# EAGLE design BackscatterPlantSensor_v6_3tssop_coax_rmi_2layer (EAGLE 6.4)

## Sheet 1 of 4
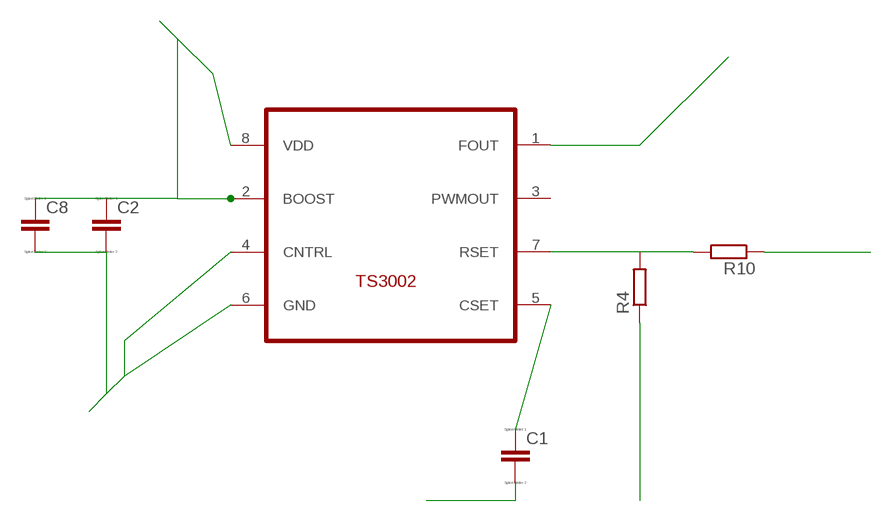
[diagram p0: schematic, sheet 1]

### Parts
C1  CC0603  [C0603]
C2  CC0603  [C0603]
C8  CC0603  [C0603]
R4  R-EU_R0603  [R0603]
R10  R-EU_R0603  [R0603]
U$1  TS3002  [TDFN22-8]

### Nets
AGND: R4.1 ; also sheet 4
DGND: C1.2 C2.2 C8.2 U$1.4(CNTRL) U$1.6(GND) ; also sheet 2
FOUT: U$1.1(FOUT) ; also sheet 2
N$1: C1.1 U$1.5(CSET)
N$2: R4.2 R10.2 U$1.7(RSET)
VCOND: R10.1 ; also sheet 4
VDD: C2.1 C8.1 U$1.2(BOOST) U$1.8(VDD) ; also sheet 3,4
Unconnected: U$1.3(PWMOUT)

## Sheet 2 of 4
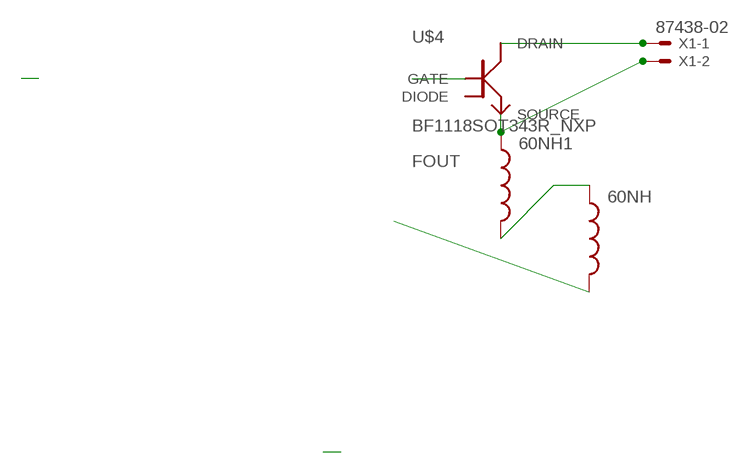
[diagram p1: schematic, sheet 2]

### Parts
60NH  INDUCTOR0402  [C0402]
60NH1  INDUCTOR0402  [C0402]
U$4  BF1118SOT343R_NXP  [SOT343R]
X1  87438-02  [87438-02]

### Nets
DGND: U$4.1(GATE) ; also sheet 1
FOUT: 60NH.2 ; also sheet 1
N$3: 60NH1.2 60NH.1
RF_MINUS: 60NH1.1 U$4.3(SOURCE) X1.2
RF_PLUS: U$4.4(DRAIN) X1.1
Unconnected: U$4.2(DIODE)

## Sheet 3 of 4
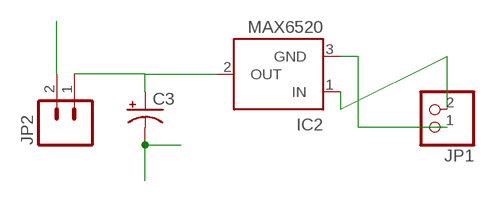
[diagram p2: schematic, sheet 3]

### Parts
C3  CAP_POL1206  [EIA3216]
IC2  MAX6520  [SOT23]
JP1  PINHD-1X2  [1X02]
JP2  M02LOCK  [1X02_LOCK]

### Nets
GND: C3.C(-) IC2.3(GND) JP1.1
N$4: IC2.1(IN) JP1.2
N$7: C3.A(+) IC2.2(OUT) JP2.1
VDD: JP2.2 ; also sheet 1,4

## Sheet 4 of 4
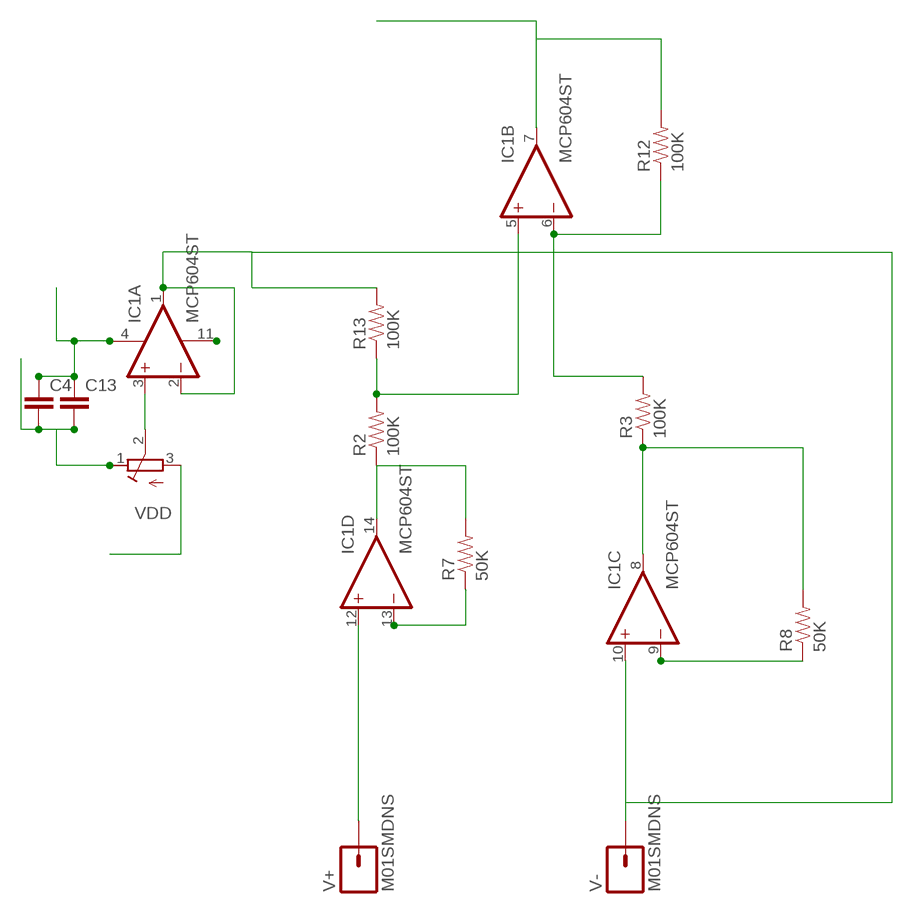
[diagram p3: schematic, sheet 4]

### Parts
C4  CAP0603-CAP  [0603-CAP]
C13  CAP0603-CAP  [0603-CAP]
IC1  MCP604ST  [TSSOP14]
R2  100K  RESISTOR  [0805]
R3  100K  RESISTOR  [0805]
R7  50K  RESISTOR  [0805]
R8  50K  RESISTOR  [0805]
R12  100K  RESISTOR  [0805]
R13  100K  RESISTOR  [0805]
V+  M01SMDNS  [1X01NS]
V-  M01SMDNS  [1X01NS]
VDD  R-TRIMM3314G  [RTRIM3314G]

### Nets
AGND: C4.2 C13.2 IC1.11(P:V-) VDD.1(E) ; also sheet 1
N$93: IC1.9(C:-IN) R8.1
N$96: IC1.8(C:OUT) R3.1 R8.2
N$99: IC1.14(D:OUT) R2.1 R7.2
N$100: IC1.6(B:-IN) R3.2 R12.1
N$119: IC1.3(A:+IN) VDD.2(S)
N$120: IC1.13(D:-IN) R7.1
N$122: IC1.5(B:+IN) R2.2 R13.1
V+: IC1.12(D:+IN) V+.1
VCOND: IC1.7(B:OUT) R12.2 ; also sheet 1
VDD: C4.1 C13.1 IC1.4(P:V+) VDD.3(A) ; also sheet 1,3
VRF: IC1.1(A:OUT) IC1.2(A:-IN) IC1.10(C:+IN) R13.2 V-.1

## Library data of the parts
60NH 60NH1 = SparkFun:INDUCTOR: Inductors Basic Inductor/Choke - 0603 and 1206. Footprints are not proven and vary greatly between part numbers.
C1 C2 C8 = eagle-ltspice:C: CAPACITOR, European symbol; SPICEMODEL: NONE; SPICEPREFIX: C
C3 = SparkFun-Capacitors:CAP_POL: Capacitor Polarized These are standard SMD and PTH capacitors. Normally 10uF, 47uF, and 100uF in electrolytic and tantalum varieties. Always verify the external diameter of the through hole cap, it varies with capacity, voltage, and manufacturer. The EIA devices should be standard.
C4 C13 = SparkFun-Passives:CAP: Capacitor Standard 0603 ceramic capacitor, and 0.1" leaded capacitor.
IC1 = linear:MCP604: Quad Op Amp 2.7V to 6.0V Single Supply CMOS Source: http://ww1.microchip.com/downloads/en/DeviceDoc/21314g.pdf
IC2 = maxim:MAX6520: 1.2V Voltage Reference 50ppm/°C, SOT23, 3-Terminal Source: Data sheet <http://datasheets.maxim-ic.com/en/ds/MAX6520.pdf>; MF: MAXIM; MPN: MAX6520EUR-T; OC_FARNELL: unknown; OC_NEWARK: 02J4586
JP1 = pinhead:PINHD-1X2: PIN HEADER
JP2 = SparkFun-Connectors:M02: Header 2 Standard 2-pin 0.1" header. Use with straight break away headers (SKU : PRT-00116), right angle break away headers (PRT-00553), swiss pins (PRT-00743), machine pins (PRT-00117), and female headers (PRT-00115). Molex polarized connector foot print use with SKU : PRT-08233 with associated crimp pins and housings.
R2 R3 R7 R8 R12 R13 = SparkFun:RESISTOR: Resistor Basic schematic elements and footprints for 0603, 1206, and PTH 1/10th watt (small) resistors.
R4 R10 = rcl:R-EU_: RESISTOR, European symbol
U$1 = ts3002TDFN22_8pin:TS3002
U$4 = rf_transistors:BF1118
V+ V- = SparkFun-Connectors:M01: Header 1 Standard 1-pin 0.1" header. Use with straight break away headers (SKU : PRT-00116), right angle break away headers (PRT-00553), swiss pins (PRT-00743), machine pins (PRT-00117), and female headers (PRT-00115).
VDD = rcl:R-TRIMM: Trimm resistor
X1 = con-molex:87438-02: Wire-to-Board 1.50mm (.059") Pitch Header - Right Angle, SMT, Shrouded Source: http://www.molex.com/product/micro/87438.html; OC_FARNELL: 1711327; OC_NEWARK: unknown

## Board
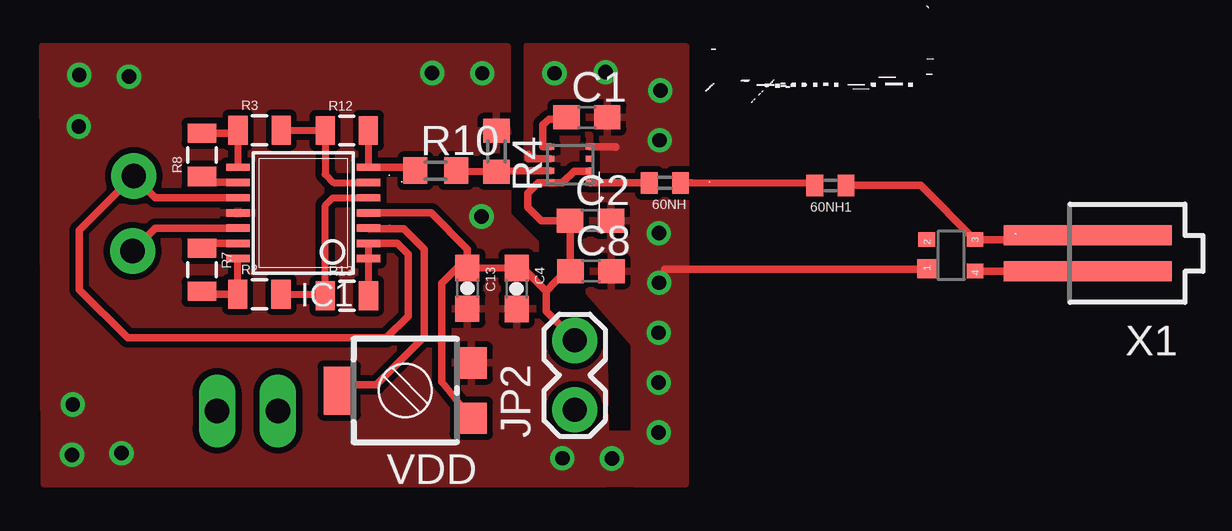
[diagram p4: board, top side]
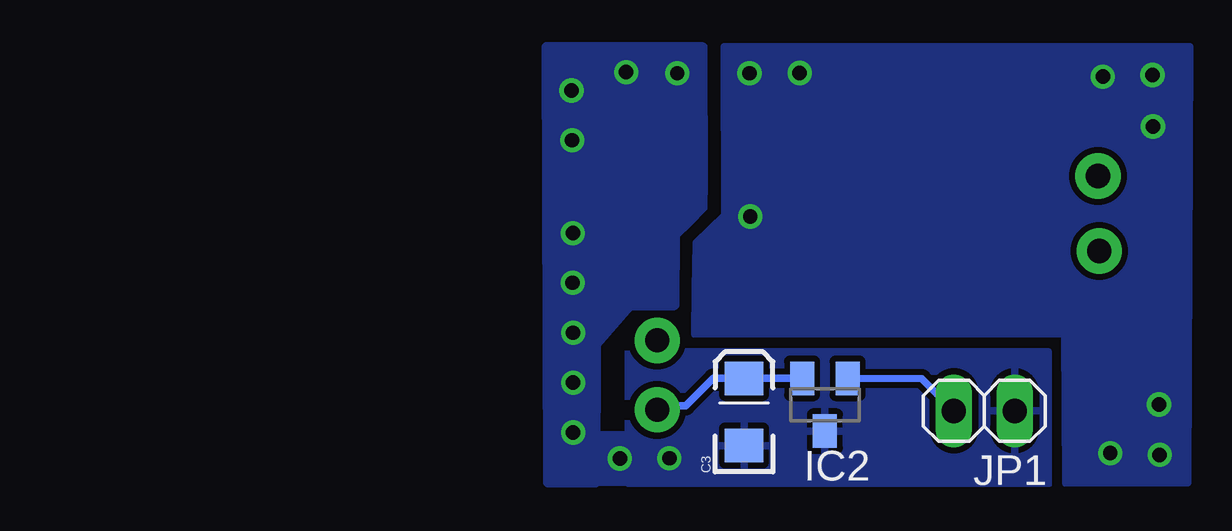
[diagram p5: board, bottom side, seen from below]

No outline drawn. Coordinates in mm, seen from the top.
Copper layers (1*16): Top 0.035mm / dielectric 1.5mm / Bottom 0.035mm
Design rules "default *": minimum track width 10mil, minimum drill 24mil, track to track 10mil, track to pad 10mil, pad to pad 10mil, via to via 10mil, smd to smd 10mil, copper to edge 40mil, drill to drill 8mil, minimum pad ring 10mil, minimum via ring 8mil, stop-mask expansion 4mil, vias tented up to drill 0mil, thermal gap 10mil

### Footprints (pad centres in the part's own frame; a part is rotated, then mirrored left to right if it is on the bottom)
C0402 = smd 0.7 x 0.9: 1 -0.65,0; 2 0.65,0
C0603 = smd 1.1 x 1: 1 -0.85,0; 2 0.85,0
EIA3216 = smd 1.4 x 1.6: A 1.4,0; C -1.4,0
0603-CAP = smd 1.1 x 1: 1 -0.85,0; 2 0.85,0
TSSOP14 = smd 0.305 x 0.991: 1 -1.905,-2.718; 2 -1.27,-2.718; 3 -0.635,-2.718; 4 0,-2.718; 5 0.635,-2.718; 6 1.27,-2.718; 7 1.905,-2.718; 8 1.905,2.718; 9 1.27,2.718; 10 0.635,2.718; 11 0,2.718; 12 -0.635,2.718; 13 -1.27,2.718; 14 -1.905,2.718
SOT23 = smd 1 x 1.4: 1 -0.95,-1.1; 2 0.95,-1.1; 3 0,1.1
1X02 = drill 1.016 long: 1 -1.27,0; 2 1.27,0
1X02_LOCK = drill 1 pad 1.88: 1 -0.178,0; 2 2.718,0
0805 = smd 0.8 x 1.2: 1 -0.9,0; 2 0.9,0
R0603 = smd 1 x 1.1: 1 -0.85,0; 2 0.85,0
TDFN22-8 = smd 0.35 x 0.25: 1 -1.78,-0.7; 2 -1.78,-1.2; 3 -1.78,-1.7; 4 -1.78,-2.2; 5 -0.13,-2.2; 6 -0.13,-1.7; 7 -0.13,-1.2; 8 -0.13,-0.7
SOT343R = smd 0.8 x 0.8: 1 0.55,-1.07 | smd 0.6 x 0.7: 2 -0.66,-1.07; 3 -0.66,0.94; 4 0.65,0.94
1X01NS = drill 1.016 pad 1.88: 1 0,0
RTRIM3314G = smd 1.3 x 1.3: 1 1.15,-2.75; 3 -1.15,-2.75 | smd 2 x 1.3: 2 0,2.75
87438-02 = smd 7 x 0.85: 1 0,0.75; 2 0,-0.75

### Placement (x,y rotation side)
60NH  77.37,63.77 180 top
60NH1  84.27,63.66 180 top
C1  74.12,66.49 0 top
C2  74.27,62.19 0 top
C3  69.99,54.22 90 bottom
C4  71.19,59.36 270 top
C8  74.29,60.09 0 top
C13  69.14,59.37 270 top
IC1  62.3,62.51 90 top
IC2  66.62,54.52 180 bottom
JP1  59.98,54.26 180 bottom
JP2  73.61,54.48 90 top
R2  60.48,59.12 0 top
R3  60.48,65.96 0 top
R4  70.35,65.08 270 top
R7  58.08,60.14 270 top
R8  58.08,64.93 90 top
R10  67.82,64.27 0 top
R12  64.11,65.94 0 top
R13  64.12,59.06 0 top
U$1  72.46,63.06 180 top
U$4  89.35,60.74 270 top
V+  55.19,60.93 0 top
V-  55.24,64.05 270 top
VDD  66.55,55.11 90 top
X1  94.99,60.83 180 top

### Tracks (layer width: path | path; a pad name or v marks a point on that pad's centre or on a via)
AGND  (via drill 0.6)
  other vias: 69.73,62.36 52.7,54.53 55.04,68.19 67.67,68.34 69.76,68.33 52.67,52.43 54.73,52.5 52.97,68.26 52.95,66.11
  pour Top: 51.44,69.45 51.51,51.23 74.91,51.22 74.85,56.73 72.02,59.09 71.97,61.27 70.82,62.41 70.81,69.44
  pour Bottom: 70.82,69.44 51.42,69.43 51.5,51.27 56.58,51.25 56.62,57.45 71.75,57.47 72.04,57.45 72.02,59.33 71.97,61.26 70.8,62.42
DGND  (via drill 0.6)
  Top 0.254: U$1.4 74.76,65.26 74.78,65.28
  Top 0.305: C2.2 74.72,61.84 | U$1.6 71.67,64.76 71.67,64.95 | U$1.4 75.32,65.26 75.32,65.25 | U$4.1 88.24,60.23 88.24,60.16 77.36,60.16
  other vias: 77.15,65.54 77.18,67.61 77.12,61.67 77.13,59.6 77.11,57.52 77.11,55.44 77.11,53.36 72.77,68.33 74.9,68.38
  pour Bottom: 71.7,69.41 78.22,69.42 78.16,51.28 76.17,51.27 76.15,57.07 74.75,58.67 72.88,58.67 72.86,61.61 72.3,62.15 71.7,62.75 71.69,63.74
  pour Top: 71.63,69.45 78.24,69.43 78.21,51.22 76.1,51.23 76.1,57.07 74.18,59.25 73.96,63.76 71.64,63.79
FOUT
  Top 0.305: U$1.1 75.82,63.76 60NH.2
GND
  pour Bottom: 57.27,51.24 74.82,51.24 74.82,56.73 57.31,56.73 57.32,51.29
JUNC  (via drill 0.6)
  other vias: 75.16,52.28 73.1,52.29
  pour Top: 72.04,53.31 72.07,51.25 76.22,51.22 76.21,53.28
  pour Bottom: 76.29,51.28 76.26,53.29 72.22,53.24 72.12,51.25
N$1
  Top 0.305: U$1.5 72.33,65.26 72.29,65.26 72.29,66.19 72.55,66.41 73.19,66.41 C1.1
N$2
  Top 0.305: R10.2 69.04,64.25 R4.2 71.11,64.26 U$1.7
N$3
  Top 0.305: 78.49,63.76 60NH.1 83.62,63.75 60NH1.2
N$4
  Bottom 0.305: JP1.2 62.58,55.6 IC2.1
N$7
  Bottom 0.305: IC2.2 C3.A 71.26,55.62 72.41,54.47 73.61,54.47 JP2.1
N$93
  Top 0.305: IC1.9 58.33,63.78 R8.1
N$96
  Top 0.3: R3.1 IC1.8
  Top 0.305: IC1.8 | R8.2 59.45,65.83 R3.1
N$99
  Top 0.3: R2.1 IC1.14
  Top 0.305: IC1.14 | R2.1 57.98,59.12 R7.2
N$100
  Top 0.3: R12.1 63.22,64.12 63.55,63.78 IC1.6
  Top 0.305: R3.2 R12.1
N$119
  Top 0.3: IC1.3 65.9,61.88
  Top 0.305: IC1.3 65.03,61.86 66.48,61.86 67.34,61 67.34,57.36 65.34,55.36 63.8,55.36 VDD.2
N$120
  Top 0.305: IC1.13 58.1,61.24 R7.1
N$122
  Top 0.3: R13.1 63.22,62.83 63.53,63.14 65.01,63.14 IC1.5
  Top 0.305: R2.2 63.3,59.1 R13.1
RF_MINUS
  Top 0.305: X1.2 91.83,61.4 U$4.3 88.03,63.66 60NH1.1
RF_PLUS
  Top 0.305: U$4.4 91.99,60.09 X1.1
V+
  Top 0.305: V+.1 56.14,61.88 IC1.12
VCOND
  Top 0.3: R12.2 IC1.7
  Top 0.305: 67.13,64.27 R10.1 66.97,64.42 IC1.7
VDD
  Top 0.305: U$1.2 73.6,64.25 73.1,63.76 U$1.8 72.1,63.76 71.65,63.33 71.65,62.74 72.21,62.19 C2.1 73.42,60.15 C8.1 73.24,60.1 72.42,59.25 | 65.03,62.52 IC1.4 67.63,62.51 69.14,61 C13.1 | C13.1 C4.1 71.47,60.21 72.42,59.25 | VDD.3 68.08,55.47 68.08,59.58 68.76,60.26 C13.1 | JP2.2 72.42,58.41 72.42,59.25
VRF
  Top 0.3: 65.01,59.12 IC1.1 IC1.2
  Top 0.305: 64.99,58.78 R13.2 65.01,59.12 | IC1.10 56.15,63.15 V-.1 52.97,61.78 52.97,59.31 54.98,57.3 65.77,57.3 66.68,58.21 66.68,60.79 66.23,61.24 IC1.2